# Altium project Altium project.PrjPcb
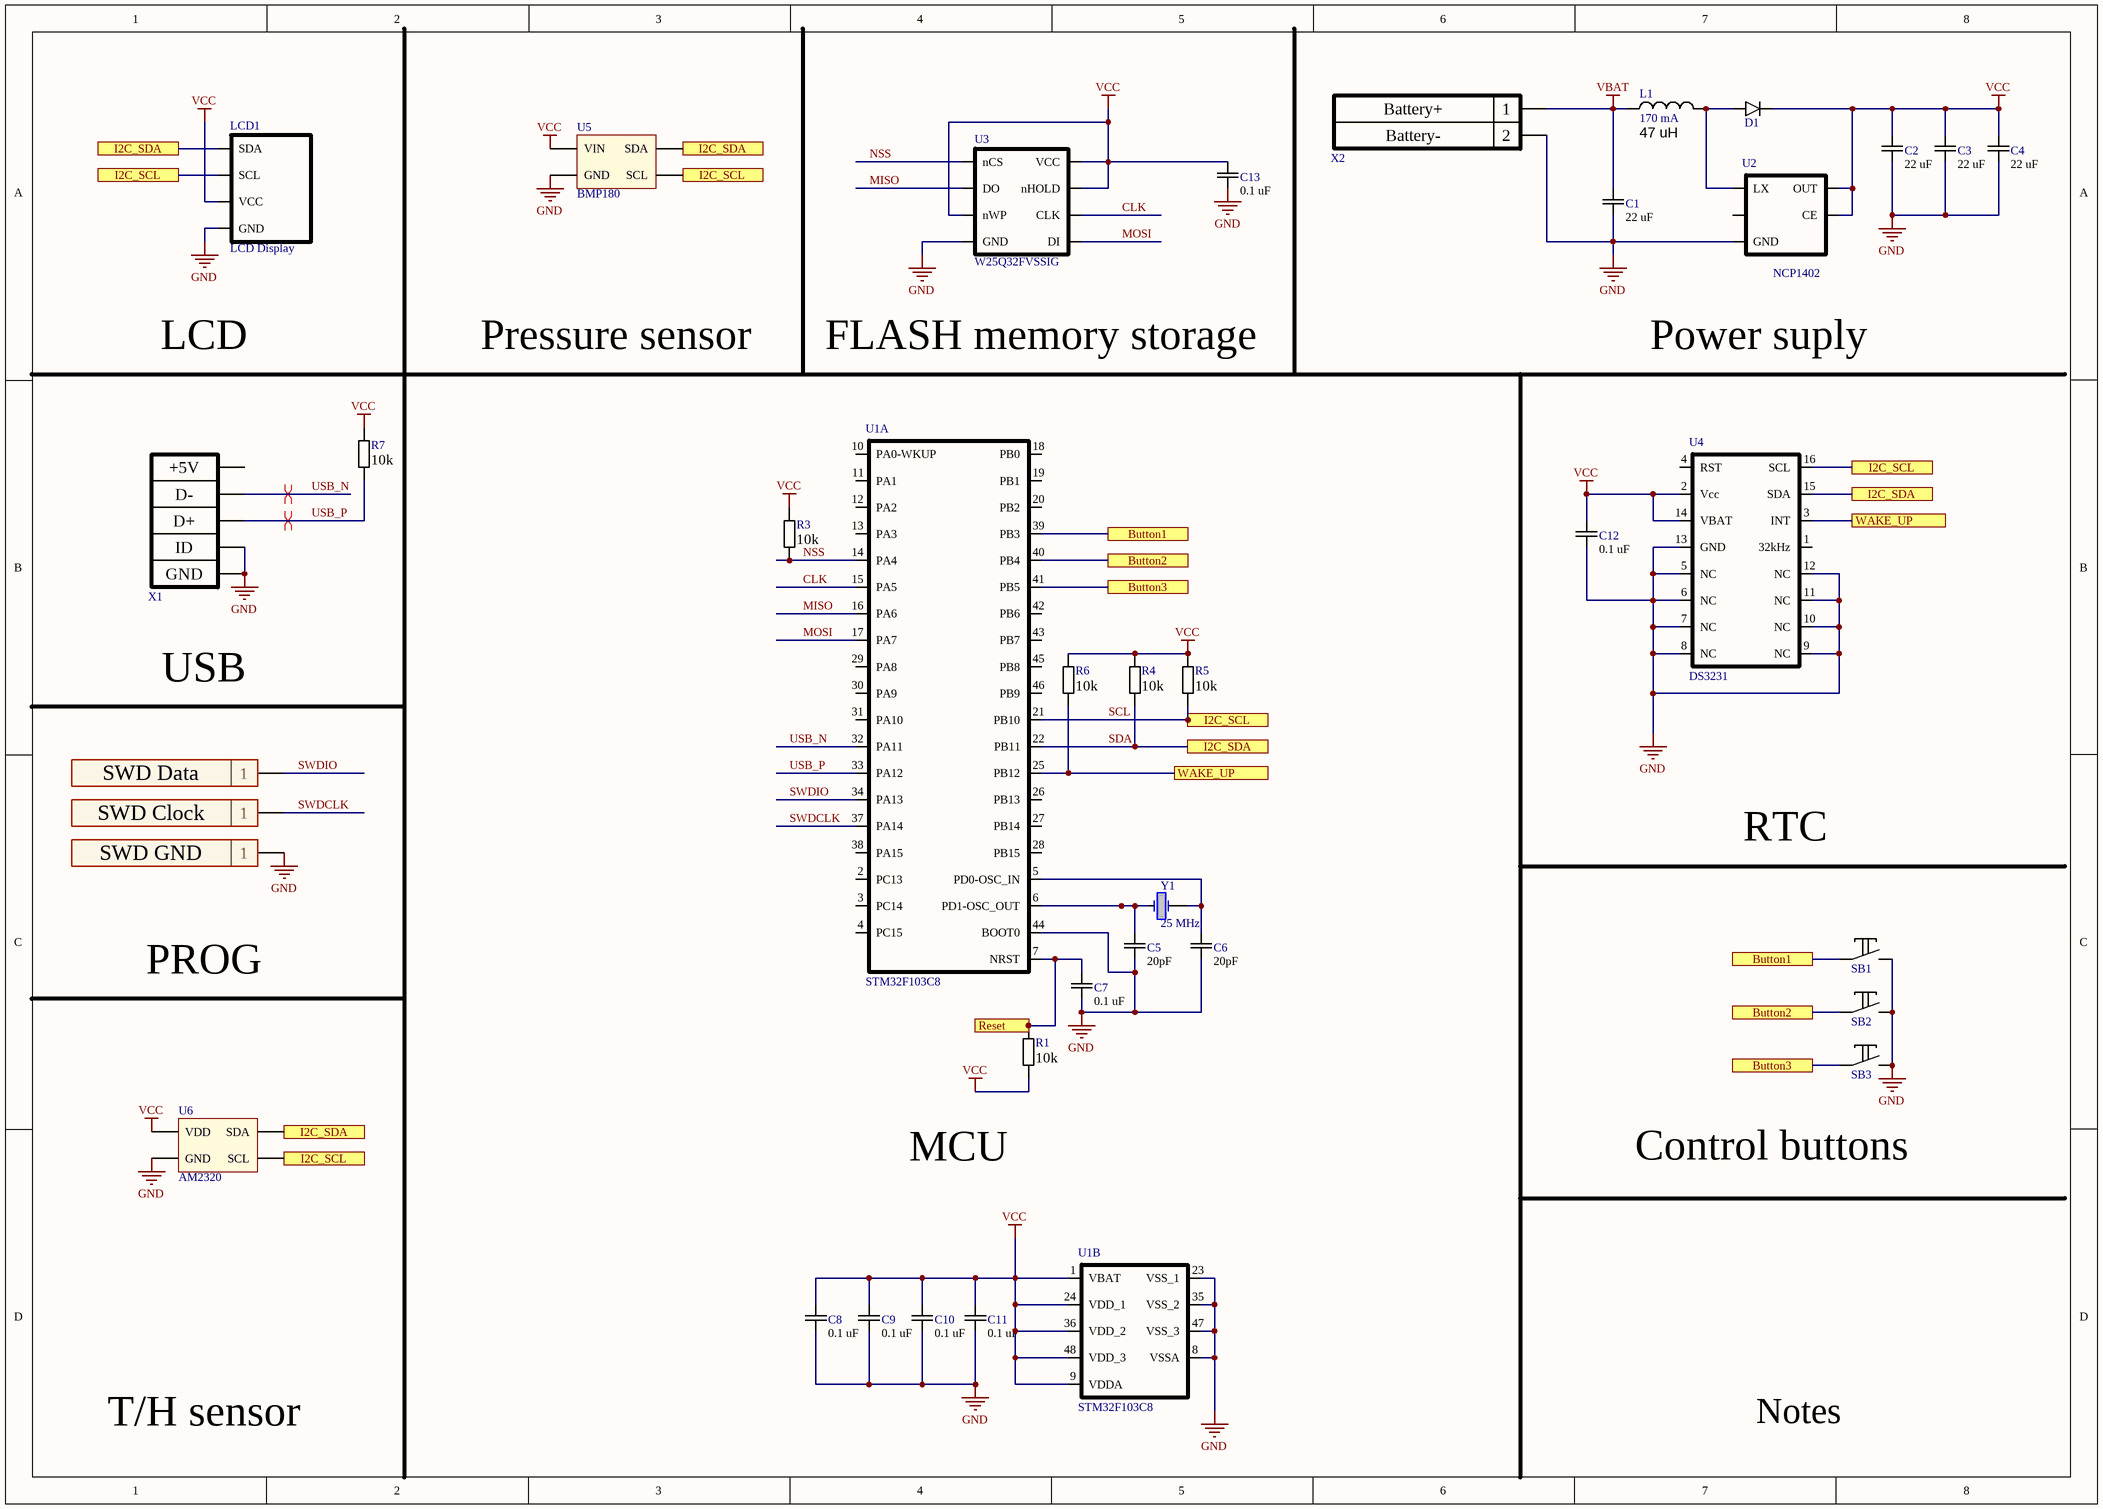
[diagram p0: weather station PCB.SchDoc]
1 sheet, 37 parts. Net scope: flat (ports and power ports of the same name join across sheets).
Board file: weather station SCH.PcbDoc

## Sheet weather station PCB.SchDoc
size A3

### Parts
C1  value 22 uF  [C0603]  (hidden comment: Capacitor)
C2  value 22 uF  [C0603]  (hidden comment: Capacitor)
C3  value 22 uF  [C0603]  (hidden comment: Capacitor)
C4  value 22 uF  [C0603]  (hidden comment: Capacitor)
C5  value 20pF  [C0805]  (hidden comment: Capacitor)
C6  value 20pF  [C0805]  (hidden comment: Capacitor)
C7  value 0.1 uF  [C0603]  (hidden comment: Capacitor)
C8  value 0.1 uF  [C0603]  (hidden comment: Capacitor)
C9  value 0.1 uF  [C0603]  (hidden comment: Capacitor)
C10  value 0.1 uF  [C0603]  (hidden comment: Capacitor)
C11  value 0.1 uF  [C0603]  (hidden comment: Capacitor)
C12  value 0.1 uF  [C0603]  (hidden comment: Capacitor)
C13  value 0.1 uF  [C0603]  (hidden comment: Capacitor)
CLK  Connector  [1 Hole]  (value not drawn)
D1  Diode  [SOD123]  (value not drawn)
GND  Connector  [1 Hole]  (value not drawn)
IO  Connector  [1 Hole]  (value not drawn)
L1  value 47 uH  Current: 170 mA  [LQH32CN]  (hidden comment: Inductor)
LCD1  LCD Display  [LCD 0.91inch module]
R1  value 10k  [R0805]  (hidden comment: Resistor)
R3  value 10k  [R0805]  (hidden comment: Resistor)
R4  value 10k  [R0805]  (hidden comment: Resistor)
R5  value 10k  [R0805]  (hidden comment: Resistor)
R6  value 10k  [R0805]  (hidden comment: Resistor)
R7  value 10k  [R0805]  (hidden comment: Resistor)
SB1  Tact Switch  [Button SMD]  (value not drawn)
SB2  Tact Switch  [Button SMD]  (value not drawn)
SB3  Tact Switch  [Button SMD]  (value not drawn)
U1  STM32F103C8  [LQFP-48]  (parts A,B of 2)
U2  NCP1402  [SOT-23-5]
U3  Flash memory  [SOIC-8]  (value not drawn)
U4  DS3231  [SOIC_W16]
U5  Pressure sensor  [BMP180 rotated]  (value not drawn)
U6  AM2320  [AM2320 bended]
X1  Connector  [Micro USB]  (value not drawn)
X2  Connector  [2 Holes]  (value not drawn)
Y1  value 25 MHz  [KX - 13]  (hidden comment: Crystal Oscillator)

### Ports
Button1, Button2, Button3, I2C_SCL, I2C_SDA, Reset, WAKE_UP

### Nets
GND: C1.1 C2.1 C3.1 C4.1 C5.1 C6.1 C7.1 C8.1 C9.1 C10.1 C11.1 C12.1 C13.1 GND.1 LCD1.4(GND) SB1.2 SB2.2 SB3.2 U1.8(VSSA) U1.23(VSS_1) U1.35(VSS_2) U1.44(BOOT0) U1.47(VSS_3) U2.4(GND) U3.4(GND) U4.5(NC) U4.6(NC) U4.7(NC) U4.8(NC) U4.9(NC) U4.10(NC) U4.11(NC) U4.12(NC) U4.13(GND) U5.GND U6.GND X1.4 X1.5 X2.2
VBAT: C1.2 L1.1 X2.1
VCC: C2.2 C3.2 C4.2 C8.2 C9.2 C10.2 C11.2 C12.2 C13.2 D1.K LCD1.3(VCC) R1.2 R3.2 R4.2 R5.2 R6.2 R7.2 U1.1(VBAT) U1.9(VDDA) U1.24(VDD_1) U1.36(VDD_2) U1.48(VDD_3) U2.1(CE) U2.2(OUT) U3.3(nWP) U3.7(nHOLD) U3.8(VCC) U4.2(Vcc) U4.14(VBAT) U5.VIN U6.VDD
CLK: U1.15(PA5) U3.6(CLK)
MISO: U1.16(PA6) U3.2(DO)
MOSI: U1.17(PA7) U3.5(DI)
NSS: R3.1 U1.14(PA4) U3.1(nCS)
SCL: LCD1.2(SCL) R5.1 U1.21(PB10) U4.16(SCL) U5.SCL U6.SCL ; port I2C_SCL
SDA: LCD1.1(SDA) R4.1 U1.22(PB11) U4.15(SDA) U5.SDA U6.SDA ; port I2C_SDA
SWDCLK: CLK.1 U1.37(PA14)
SWDIO: IO.1 U1.34(PA13)
USB_N: U1.32(PA11) X1.2
USB_P: R7.1 U1.33(PA12) X1.3
NetC5_2: C5.2 U1.6(PD1-OSC_OUT) Y1.2
NetC6_2: C6.2 U1.5(PD0-OSC_IN) Y1.1
NetC7_2: C7.2 R1.1 U1.7(NRST) ; port Reset
NetD1_A: D1.A L1.2 U2.5(LX)
NetR6_1: R6.1 U1.25(PB12) U4.3(INT) ; port WAKE_UP
NetSB1_1: SB1.1 U1.39(PB3) ; port Button1
NetSB2_1: SB2.1 U1.40(PB4) ; port Button2
NetSB3_1: SB3.1 U1.41(PB5) ; port Button3

Not connected (* = marked no-connect by the designer): U1 2(PC13) 3(PC14) 4(PC15) 10(PA0-WKUP) 11(PA1) 12(PA2) 13(PA3) 18(PB0) 19(PB1) 20(PB2) 26(PB13) 27(PB14) 28(PB15) 29(PA8) 30(PA9) 31(PA10) 38(PA15) 42(PB6) 43(PB7) 45(PB8) 46(PB9); U2 3(NC); U4 1(32kHz) 4(RST); X1 0 1

### Layout directives
differential pair: USB_N, USB_P

### Notes on the sheet
- Battery+
- Battery-
- LCD
- Pressure sensor
- FLASH memory storage
- Power suply
- USB
- SWD Data
- SWD Clock
- SWD GND
- RTC
- PROG
- MCU
- Control buttons
- T/H sensor
- Notes
- (in symbol Micro/MiniUSB) +5V; D-; D+; ID; GND

### Library data of the parts
C1-C13 = Capacitor: Capacitor non-polar; Precision: 5%; Isolation type: X7R; Voltage: 50V; Part Number: *; Package: 0805
CLK GND IO = Connector 1: Part Number: *
D1 = Diode: Part Number: PMEG2010ER,115
L1 = Inductor: Coil Inductor; Part Number: B82472G6154M; Изготовитель: EPCOS /  TDK; URL: https://www.tdk-electronics.tdk.com/inf/30/db/ind_2008/b82464g4.pdf
LCD1 = Display LCD 0.91
R1 R3-R7 = Resistor: Precision: 1%; Package: 0805
SB1-SB3 = Button: Part Number: KLS7-TS6601-11-180
U1 = STM32F100C4: Microcontroller; Part Number: STM32F103C8
U2 = NCP1402: DC/DC Converter
U3 = W25Q32FVSSIG: Part Number: W25Q32FVSSIG
U5 = BMP180: Part Number: BMP180
U6 = AM2320: Temperature/Humadity Module; Part Number: AM2320
X1 = Micro/MiniUSB
X2 = Connector 2: Part Number: 15EDGRM-3.81-02P